# EasyEDA Pro project ProProject_AT32F403ACGT6_2024-07-07.epro

# Schematic Schematic1
Create Date: 2024-06-18; Page Name: P1; Project Name: AT32F403ACGT6; Schematic Name: Schematic1; Update Date: 2024-06-18; Company: 嘉立创EDA; Page Size: A4; Version: V1.0
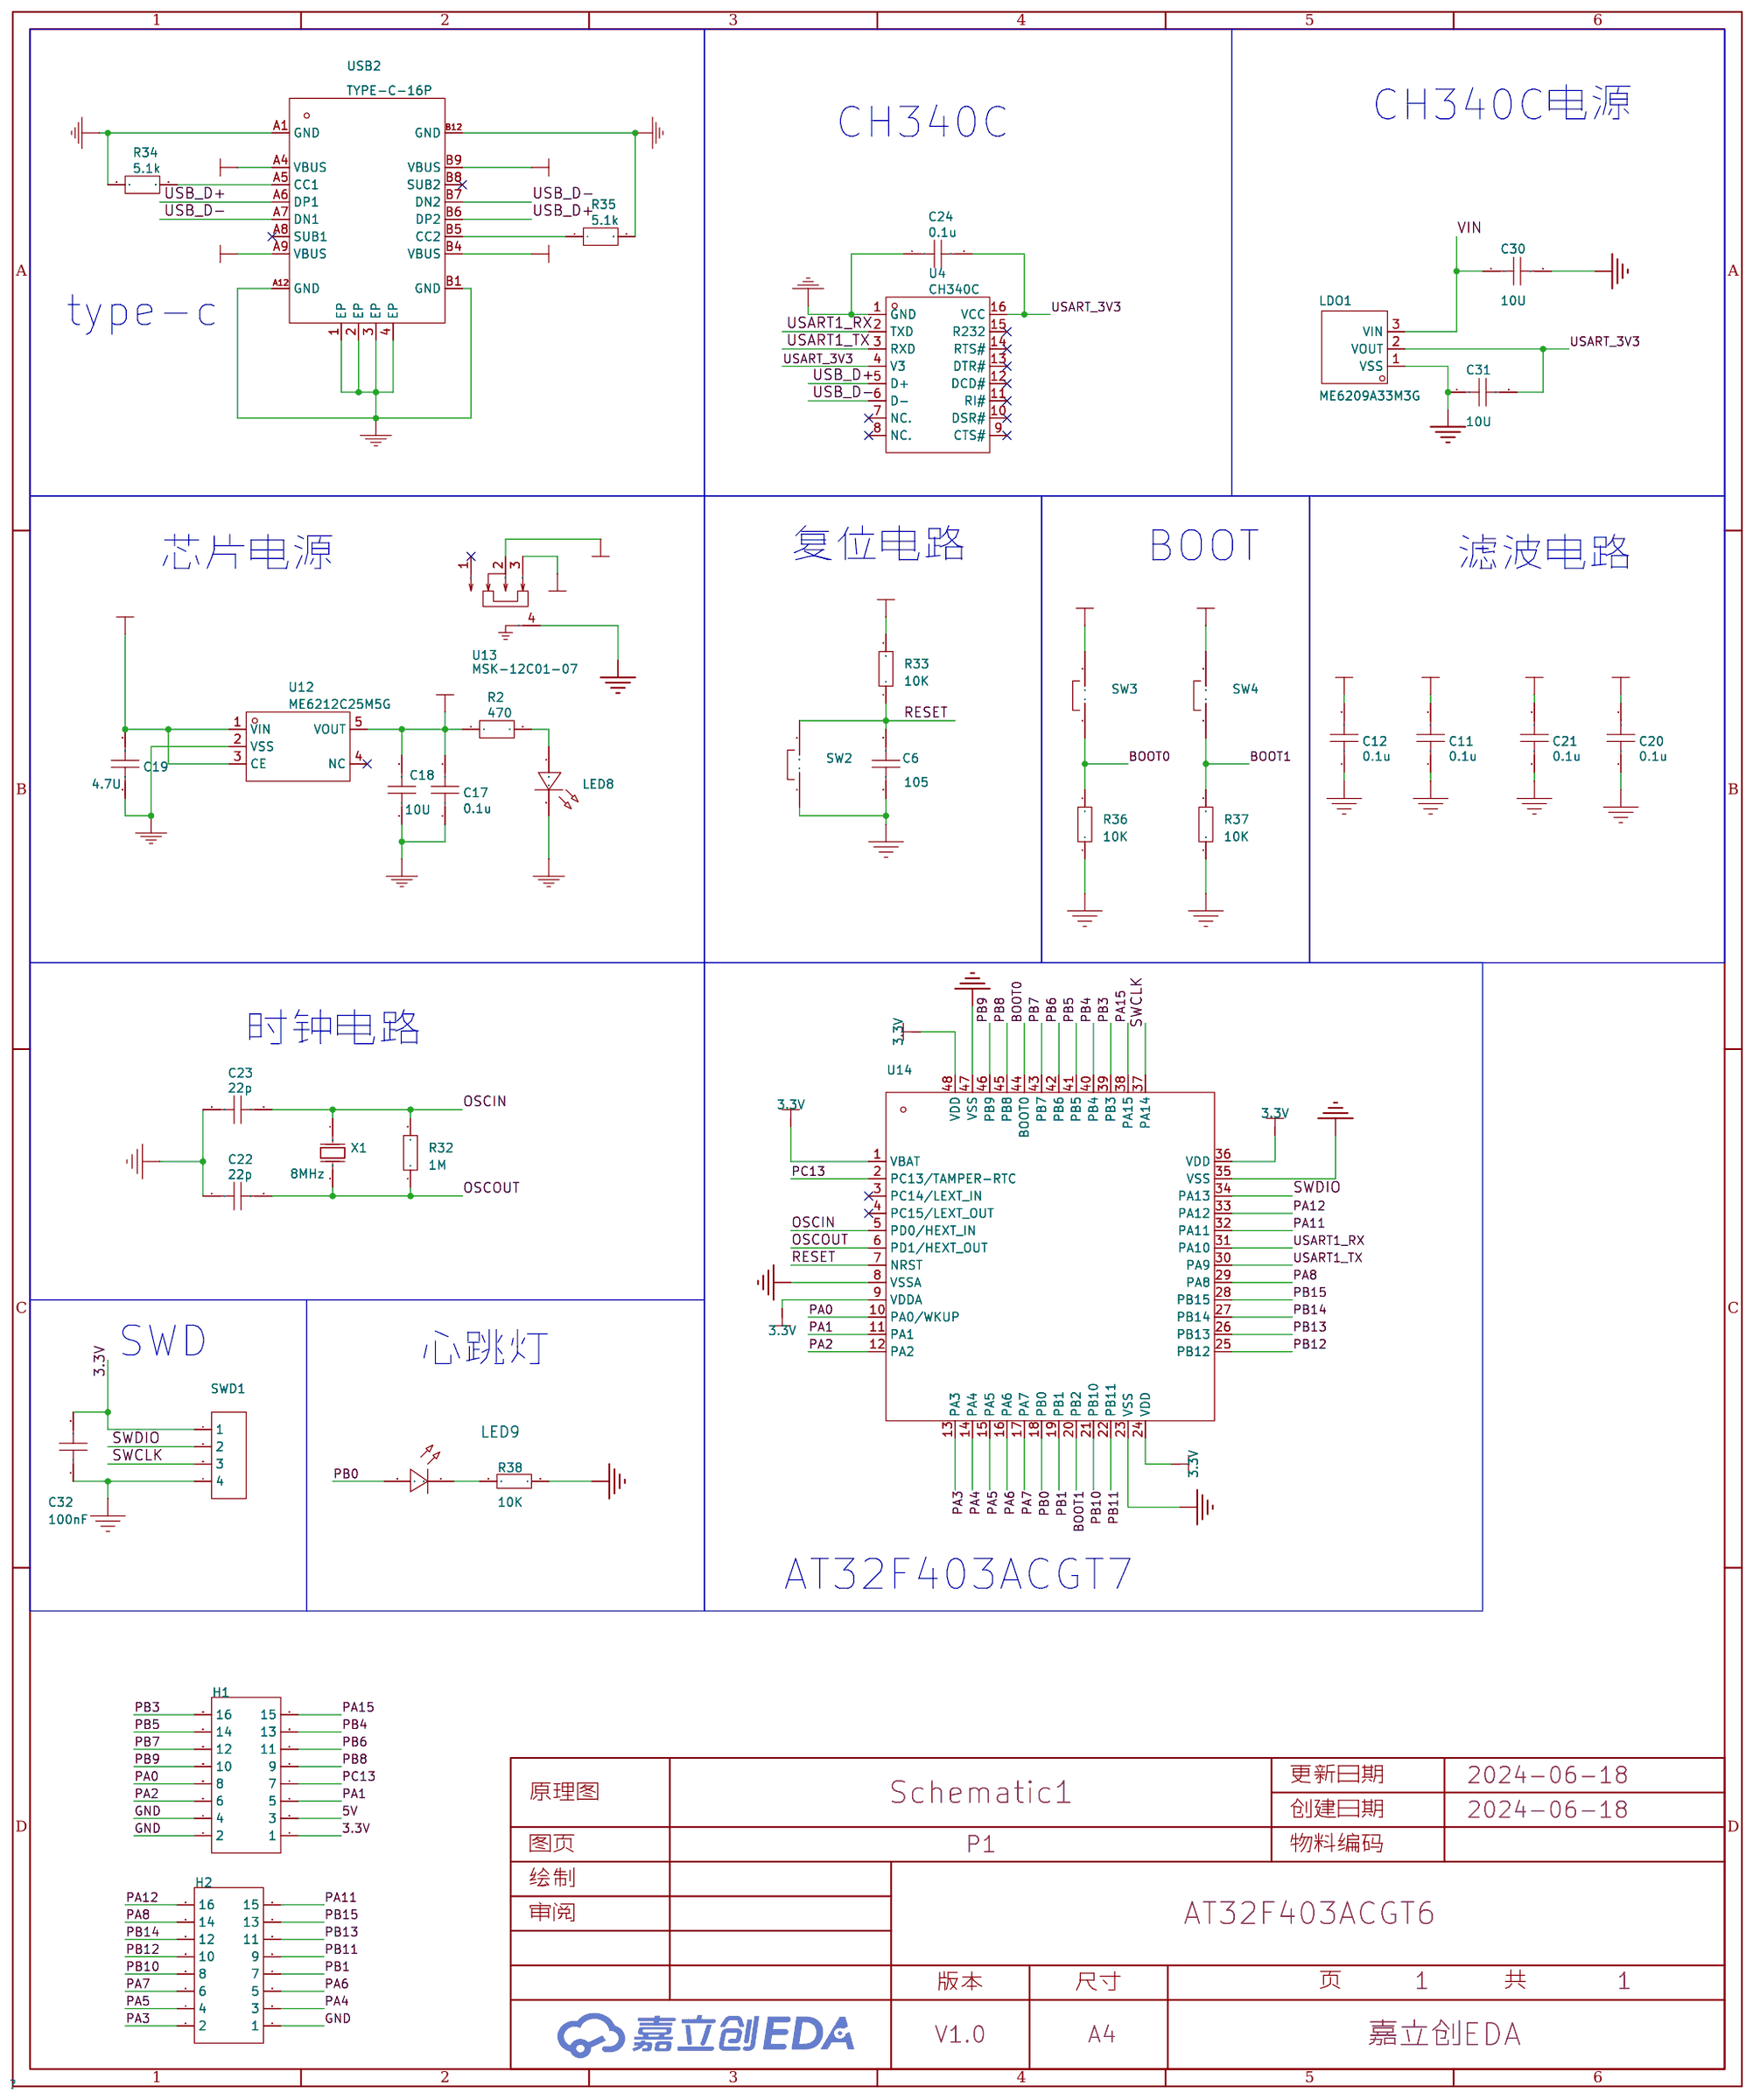
[diagram p0: schematic sheet]

## Parts
C6  105  [footprint_88df]
C11  0.1u  [footprint_88df]
C12  0.1u  [footprint_88df]
C17  0.1u  [footprint_d063]
C18  10U  [footprint_d063]
C19  4.7U  [footprint_d063]
C20  0.1u  [footprint_88df]
C21  0.1u  [footprint_88df]
C22  22p  [footprint_88df]
C23  22p  [footprint_88df]
C24  0.1u  [footprint_d063]
C30  10U  [C0603]
C31  10U  [C0603]
C32  100nF  [C0603]
H1  -  [HDR-TH_16P-P2.54-V-M-R2-C8-S2.54]
H2  -  [HDR-TH_16P-P2.54-V-M-R2-C8-S2.54]
LDO1  ME6209A33M3G  [SOT-23-3_L2.9-W1.6-P1.90-LS2.8-BR]
LED8  LED-0603_R  [footprint_1210]
LED9  -  [LED_0603]
R2  470  [footprint_1dde]
R32  1M  [R0603]
R33  10K  [R0603]
R34  5.1k  [footprint_1dde]
R35  5.1k  [footprint_1dde]
R36  10K  [R0603]
R37  10K  [R0603]
R38  10K  [R0603]
SW2  3*6*5贴片按键开关  [footprint_ea54]
SW3  3*6*5贴片按键开关  [footprint_ea54]
SW4  3*6*5贴片按键开关  [footprint_ea54]
SWD1  HDR-M-2.54_1x4  [footprint_c5e7]
U4  CH340C  [footprint_26da]
U12  ME6212C25M5G  [footprint_203e]
U13  MSK-12C01-07  [SW-SMD_MSK12CO2-BDM]
U14  -  [LQFP-48_L7.0-W7.0-P0.50-LS9.0-BL]
USB2  TYPE-C-16P  [footprint_feef]
X1  8MHz  [CRYSTAL-SMD_L11.5-W4.8-LS12.7]

## Library data of the parts
C6 = 105
C11 C12 C20 C21 = 1u
C17 C24 = 0.1u
C18 = 10U
C19 = 4.7U
C22 C23 = 22p
C30-C32 = CAP_0603: Supplier Footprint: 0603
H1 H2 = HDR-M_2.54_2x8: Supplier Part: C68234; Supplier Footprint: 插件,P=2.54mm
LDO1 = ME6209A33M3G: 输出类型:固定;最大输入电压:18V;输出电压:3.3V;最大输出电流:250mA;电源纹波抑制比(PSRR):-;输出极性:正极;; LCSC Part Name: 输入18V 输出3.3V 250mA; Supplier Part: C83508; Manufacturer: MICRONE(南京微盟); Supplier Footprint: SOT-23-3L; JLCPCB Part Class: 扩展库; Datasheet: https://atta.szlcsc.com/upload/public/pdf/source/20161212/1481539101152.pdf; Supplier: LCSC; Output Type: 固定; Maximum Input Voltage: 18V; Output Voltage: 3.3V; MAX Output Current: 250mA; Dropout Voltage: 80mV@(40mA); Output Polarity: 正极; Number of Outputs: 1
LED8 = LED-0603_R: Manufacturer: EVERLIGHT(台湾亿光); Manufacturer Part: 19-217/R6C-AL1M2VY/3T; Supplier Part: C72044; Supplier: LCSC
LED9 = LED_0603-R: Supplier Footprint: 0603
R2 = 470
R32 R33 R36-R38 = Res_0603: Supplier Footprint: 0603
R34 R35 = 5.1k
SW2-SW4 = 3*6*5贴片按键开关
SWD1 = HDR-M-2.54_1x4: Supplier Part: C124378; Supplier: LCSC
U4 = CH340C
U12 = ME6212C25M5G: Supplier: LCSC; Supplier Part: C2911282; Manufacturer: MICRONE(南京微盟); JLCPCB Part Class: Extended Part; link: https://so.szlcsc.com/global.html?k=C2911282&amp;ref=editor
U13 = MSK-12C01-07: Supplier: LCSC; Supplier Part: C9900005167; Manufacturer: null; JLCPCB Part Class: Extended Part
U14 = AT32F403ACxT7: 由官方提供; Manufacturer: Artery Technology
USB2 = TYPE-C-16P: Supplier: LCSC; Supplier Part: C709357; Manufacturer: Shenzhen Kinghelm Elec; Manufacturer Part: KH-TYPE-C-16P; JLCPCB Part Class: Extended Part
X1 = X49SM8MSD2SC: 晶振类型:贴片晶振;频率:8MHz;常温频差:±20ppm;外接负载电容:20pF;频率稳定度(全温):±30ppm;; LCSC Part Name: 8MHz ±20ppm 20pF; Supplier Part: C12674; Manufacturer: YXC(扬兴晶振); Supplier Footprint: HC-49S-SMD; JLCPCB Part Class: 基础库; Datasheet: https://atta.szlcsc.com/upload/public/pdf/source/20210329/C106809_0E91E60850A780B284B63D653DC40EA4.pdf; Supplier: LCSC; Crystal Type: 贴片晶振; Normal temperature Frequency Tolerance: ±20ppm; External load capacitor: 20pF; Frequency Stability(Full temperature range): ±30ppm; Operating Temperature: -20℃~+70℃

## Nets
3.3V: C11.2 C12.2 C17.2 C18.2 C20.2 C21.2 C32.2 H1.1 R2.1 R33.2 SW3.2 SW4.2 SWD1.1 U12.5(VOUT) U14.1(VBAT) U14.9(VDDA) U14.24(VDD) U14.36(VDD) U14.48(VDD)
5V: C19.2 H1.3 U12.1(VIN) U12.3(CE) U13.2
GND: C6.1 C11.1 C12.1 C17.1 C18.1 C19.1 C20.1 C21.1 C22.1 C23.1 C24.1 C30.2 C31.1 C32.1 H1.2 H1.4 H2.1 LDO1.1(VSS) LED8.2 R34.1 R35.2 R36.1 R37.1 R38.2 SW2.1 SWD1.4 U4.1(GND) U12.2(VSS) U13.4 U14.8(VSSA) U14.23(VSS) U14.35(VSS) U14.47(VSS) USB2.1(EP) USB2.2(EP) USB2.3(EP) USB2.4(EP) USB2.A1(GND) USB2.A12(GND) USB2.B1(GND) USB2.B12(GND)
VIN: C30.1 LDO1.3(VIN) U13.3 USB2.A4(VBUS) USB2.A9(VBUS) USB2.B4(VBUS) USB2.B9(VBUS)
BOOT0: R36.2 SW3.1 U14.44(BOOT0)
BOOT1: R37.2 SW4.1 U14.20(PB2)
OSCIN: C23.2 R32.2 U14.5(PD0/HEXT_IN) X1.1(OSC1)
OSCOUT: C22.2 R32.1 U14.6(PD1/HEXT_OUT) X1.2(OSC2)
PA0: H1.8 U14.10(PA0/WKUP)
PA1: H1.5 U14.11(PA1)
PA2: H1.6 U14.12(PA2)
PA3: H2.2 U14.13(PA3)
PA4: H2.3 U14.14(PA4)
PA5: H2.4 U14.15(PA5)
PA6: H2.5 U14.16(PA6)
PA7: H2.6 U14.17(PA7)
PA8: H2.14 U14.29(PA8)
PA11: H2.15 U14.32(PA11)
PA12: H2.16 U14.33(PA12)
PA15: H1.15 U14.38(PA15)
PB0: LED9.2(A) U14.18(PB0)
PB1: H2.7 U14.19(PB1)
PB3: H1.16 U14.39(PB3)
PB4: H1.13 U14.40(PB4)
PB5: H1.14 U14.41(PB5)
PB6: H1.11 U14.42(PB6)
PB7: H1.12 U14.43(PB7)
PB8: H1.9 U14.45(PB8)
PB9: H1.10 U14.46(PB9)
PB10: H2.8 U14.21(PB10)
PB11: H2.9 U14.22(PB11)
PB12: H2.10 U14.25(PB12)
PB13: H2.11 U14.26(PB13)
PB14: H2.12 U14.27(PB14)
PB15: H2.13 U14.28(PB15)
PC13: H1.7 U14.2(PC13/TAMPER-RTC)
RESET: C6.2 R33.1 SW2.2 U14.7(NRST)
SWCLK: SWD1.3 U14.37(PA14)
SWDIO: SWD1.2 U14.34(PA13)
USART1_RX: U4.2(TXD) U14.31(PA10)
USART1_TX: U4.3(RXD) U14.30(PA9)
USART_3V3: C24.2 C31.2 LDO1.2(VOUT) U4.4(V3) U4.16(VCC)
USB_D+: U4.5(D+) USB2.A6(DP1) USB2.B6(DP2)
USB_D-: U4.6(D-) USB2.A7(DN1) USB2.B7(DN2)
$1N602: R35.1 USB2.B5(CC2)
$1N604: R34.2 USB2.A5(CC1)
$1N1124: LED8.1 R2.2
$1N4539: LED9.1(C) R38.1

Not connected (* = marked no-connect by the designer): U4 7(NC.)* 8(NC.)* 9(CTS#)* 10(DSR#)* 11(RI#)* 12(DCD#)* 13(DTR#)* 14(RTS#)* 15(R232)*; U12 4(NC)*; U13 1*; U14 3(PC14/LEXT_IN)* 4(PC15/LEXT_OUT)*; USB2 A8(SUB1)* B8(SUB2)*

## Notes on the sheet
- CH340C
- CH340C电源
- type-c
- 复位电路
- BOOT
- 芯片电源
- 滤波电路
- 时钟电路
- SWD
- 心跳灯
- AT32F403ACGT7

# Board PCB1
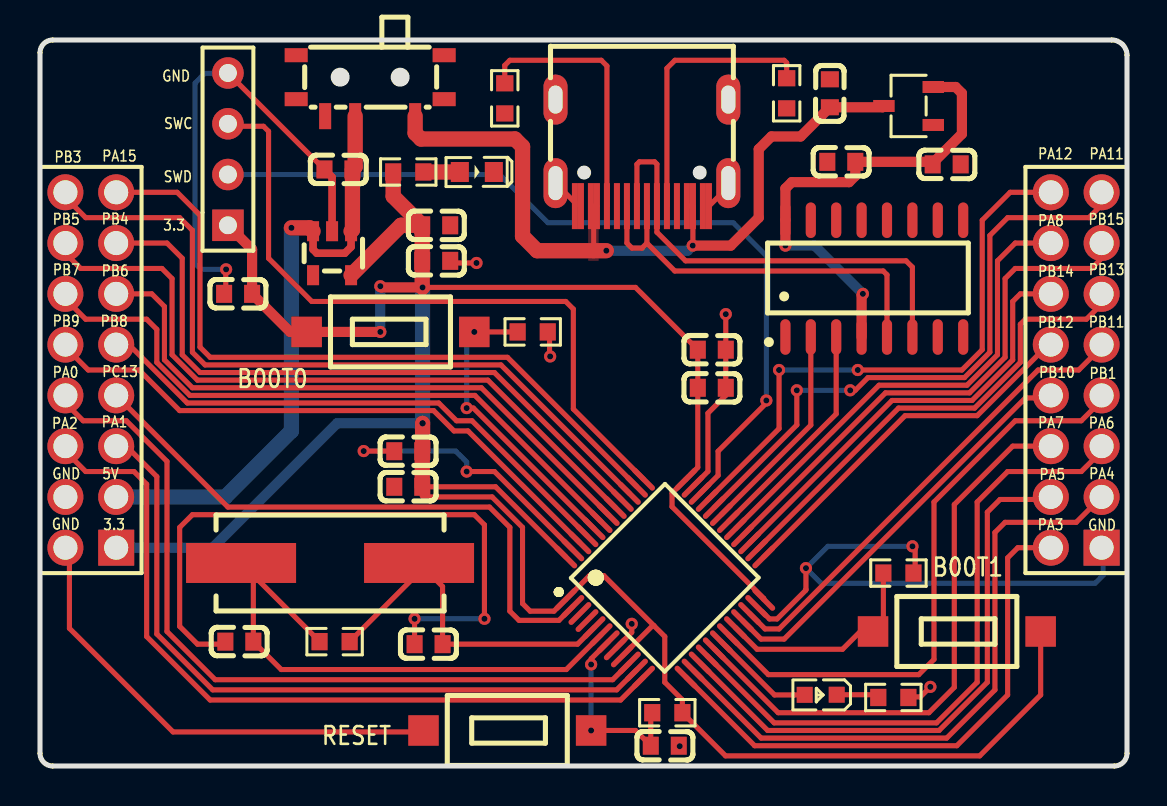
[diagram p1: board, top side]
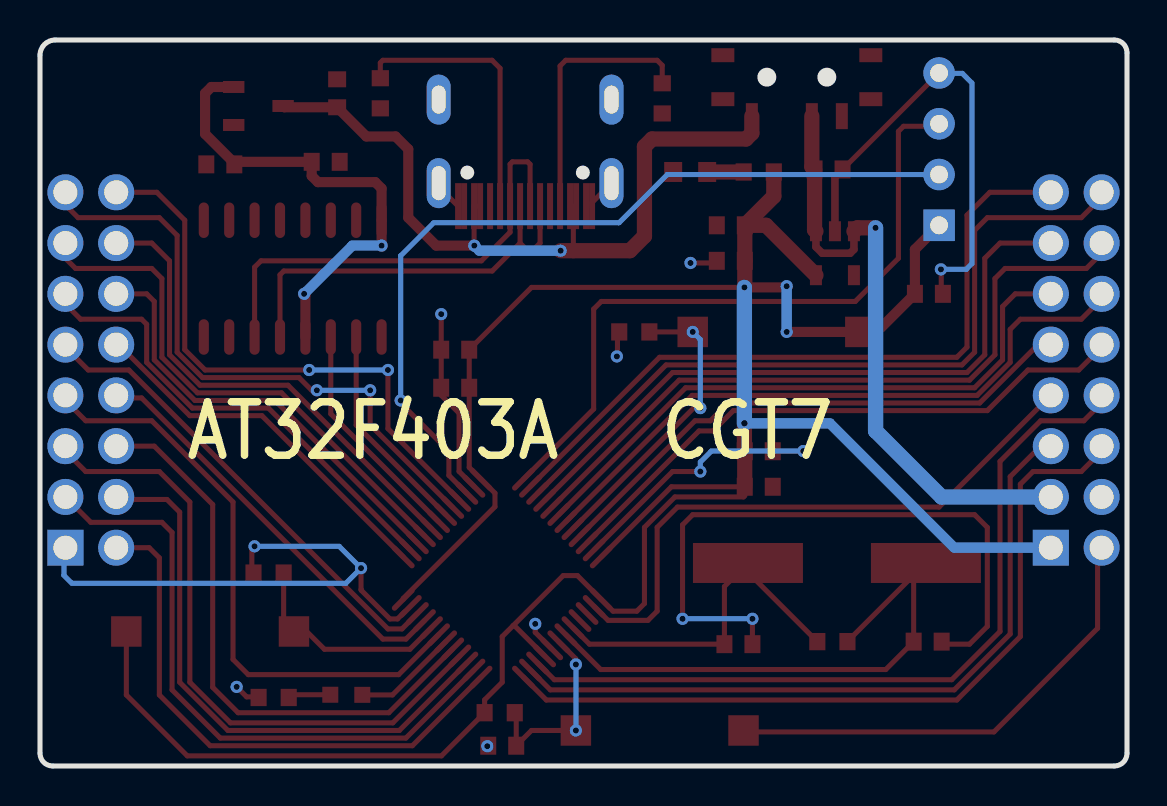
[diagram p2: board, bottom side, seen from below]

Outline 54.36 x 36.32 mm; copper layers: Top Layer, Bottom Layer. Coordinates in mm from the lower left corner of the outline.
Outline path: 0,35.69 arc(0.19,36.14) 0.63,36.32 53.59,36.32 arc(54.13,36.1) 54.36,35.56 54.36,0.63 arc(54.17,0.19) 53.72,0 0.63,0 arc(0.19,0.19) 0,0.63 0,35.69
Stack: Top Layer 0.035mm / Dielectric1 1.51mm FR4 er 4.5 / Bottom Layer 0.035mm

## Design rules (mm)
template: JLCPCB Capability(Two Layers Board)
spacing copperThickness1oz (default): track to track 0.102, other pairs 0.152 to 0.3
spacing copperThickness2oz: track to track 0.203, other pairs 0.152 to 0.3
track width copperThickness1oz (default): min 0.127, default 0.254, max 2.54
track width copperThickness2oz: min 0.203, default 0.254, max 2.54
differential pair differentialPair (default): width min 0.127, default 0.254, max 2.54; gap min 0.152, default 0.152
via viaSize (default): diameter min 0.5, default 0.61, max 10; hole min 0.3, default 0.305, max 6.3

## Placement (name value [footprint] x y rotation side)
C6  105  [footprint_88df]  31.24 1.02 180 top
C11  0.1u  [footprint_88df]  18.42 15.75 0 top
C12  0.1u  [footprint_88df]  33.59 20.83 180 top
C17  0.1u  [footprint_d063]  19.81 25.27 180 top
C18  10U  [footprint_d063]  19.81 27.05 180 top
C19  4.7U  [footprint_d063]  14.92 29.84 0 top
C20  0.1u  [footprint_88df]  33.59 18.92 180 top
C21  0.1u  [footprint_88df]  18.42 13.97 0 top
C22  22p  [footprint_88df]  9.97 6.22 0 top
C23  22p  [footprint_88df]  19.43 6.1 0 top
C24  0.1u  [footprint_d063]  45.34 30.1 180 top
C30  10U  [C0603]  39.5 33.66 90 top
C31  10U  [C0603]  40.07 30.23 0 top
C32  100nF  [C0603]  9.91 23.62 0 top
H1  -  [HDR-TH_16P-P2.54-V-M-R2-C8-S2.54]  2.54 19.81 90 top
H2  -  [HDR-TH_16P-P2.54-V-M-R2-C8-S2.54]  51.82 19.81 90 top
LDO1  ME6209A33M3G  [SOT-23-3_L2.9-W1.6-P1.90-LS2.8-BR]  43.43 33.02 0 top
LED8  LED-0603_R  [footprint_1210]  21.84 29.72 0 top
LED9  -  [LED_0603]  38.99 3.56 180 top
R2  470  [footprint_1dde]  18.42 29.72 0 top
R32  1M  [R0603]  14.73 6.22 0 top
R33  10K  [R0603]  31.37 2.67 0 top
R34  5.1k  [footprint_1dde]  37.34 33.66 90 top
R35  5.1k  [footprint_1dde]  23.24 33.4 270 top
R36  10K  [R0603]  24.64 21.72 180 top
R37  10K  [R0603]  42.93 9.65 180 top
R38  10K  [R0603]  42.67 3.43 0 top
SW2  3*6*5贴片按键开关  [footprint_ea54]  23.37 1.78 180 top
SW3  3*6*5贴片按键开关  [footprint_ea54]  17.53 21.72 0 top
SW4  3*6*5贴片按键开关  [footprint_ea54]  45.85 6.73 180 top
SWD1  HDR-M-2.54_1x4  [footprint_c5e7]  9.4 30.86 90 top
U4  CH340C  [footprint_26da]  41.27 24.38 0 top
U12  ME6212C25M5G  [footprint_203e]  14.61 25.65 180 top
U13  MSK-12C01-07  [SW-SMD_MSK12CO2-BDM]  16.51 34.04 180 top
U14  -  [LQFP-48_L7.0-W7.0-P0.50-LS9.0-BL]  31.24 9.4 315 top
USB2  TYPE-C-16P  [footprint_feef]  30.1 30.92 180 top
X1  8MHz  [CRYSTAL-SMD_L11.5-W4.8-LS12.7]  14.5 10.16 180 top

## Footprints (pads in the part's own frame, mm; a bottom-side part is the same pattern mirrored in y, then rotated)
C0603
  rect 0.8x0.9 smd: 1(-0.7,0) 2(0.7,0)
CRYSTAL-SMD_L11.5-W4.8-LS12.7
  rect 5.5x2 smd: 1(-4.45,0) 2(4.45,0)
footprint_1dde
  rect 0.806x0.864 smd: 1(-0.753,0) 2(0.753,0)
footprint_26da
  oval 0.508x1.778 smd: 1(-4,-2.921) 2(-2.731,-2.921) 3(-1.46,-2.921) 4(-0.191,-2.921) 5(1.079,-2.921) 6(2.349,-2.921) 7(3.619,-2.921) 8(4.889,-2.921) 9(4.889,2.921) 10(3.619,2.921) 11(2.349,2.921) 12(1.079,2.921) 13(-0.191,2.921) 14(-1.46,2.921) 15(-2.731,2.921) 16(-4,2.921)
footprint_88df
  rect 0.8x0.9 smd: 1(-0.7,0) 2(0.7,0)
footprint_203e
  rect 0.6x1 smd: 1(-0.95,-1.1) 2(0,-1.1) 3(0.95,-1.1) 4(0.95,1.1) 5(-0.95,1.1)
footprint_1210
  rect 0.9x1 smd: 1(-0.85,0) 2(0.85,0)
footprint_c5e7
  rect 1.575x1.575 hole 0.889: 1(-3.81,0)
  round 1.575 hole 0.889: 2(-1.27,0) 3(1.27,0) 4(3.81,0)
footprint_d063
  rect 0.8x0.9 smd: 1(-0.7,0) 2(0.7,0)
footprint_ea54
  rect 1.524x1.524 smd: 1(4.191,0) 2(-4.191,0)
footprint_feef
  oval 1.2x2.5 hole 0.7x1.7: 1(-4.32,1.765) 2(4.32,1.765)
  oval 1.2x2.5 hole 0.7x1.4: 3(-4.32,-2.415) 4(4.32,-2.415)
  rect 0.3x2.3 smd: A1(-3.35,2.915) A4(-2.55,2.915) A5(-1.25,2.915) A6(-0.25,2.915) A7(0.25,2.915) A8(1.25,2.915) A9(2.55,2.915) A12(3.35,2.915) B1(3.05,2.915) B4(2.25,2.915) B5(1.75,2.915) B6(0.75,2.915) B7(-0.75,2.915) B8(-1.75,2.915) B9(-2.25,2.915) B12(-3.05,2.915)
HDR-TH_16P-P2.54-V-M-R2-C8-S2.54
  rect 1.8x1.8 hole 1.2: 1(-8.89,-1.27)
  round 1.8 hole 1.2: 2(-8.89,1.27) 3(-6.35,-1.27) 4(-6.35,1.27) 5(-3.81,-1.27) 6(-3.81,1.27) 7(-1.27,-1.27) 8(-1.27,1.27) 9(1.27,-1.27) 10(1.27,1.27) 11(3.81,-1.27) 12(3.81,1.27) 13(6.35,-1.27) 14(6.35,1.27) 15(8.89,-1.27) 16(8.89,1.27)
LED_0603
  rect 0.8x0.8 smd: 1(-0.851,-0.01) 2(0.75,-0.005)
LQFP-48_L7.0-W7.0-P0.50-LS9.0-BL
  oval 0.27x1.5 smd: 1(-2.75,-4.25) 2(-2.25,-4.25) 3(-1.75,-4.25) 4(-1.25,-4.25) 5(-0.75,-4.25) 6(-0.25,-4.25) 7(0.25,-4.25) 8(0.75,-4.25) 9(1.25,-4.25) 10(1.75,-4.25) 11(2.25,-4.25) 12(2.75,-4.25) 25(2.75,4.25) 26(2.25,4.25) 27(1.75,4.25) 28(1.25,4.25) 29(0.75,4.25) 30(0.25,4.25) 31(-0.25,4.25) 32(-0.75,4.25) 33(-1.25,4.25) 34(-1.75,4.25) 35(-2.25,4.25) 36(-2.75,4.25)
  oval 1.5x0.27 smd: 13(4.25,-2.75) 14(4.25,-2.25) 15(4.25,-1.75) 16(4.25,-1.25) 17(4.25,-0.75) 18(4.25,-0.25) 19(4.25,0.25) 20(4.25,0.75) 21(4.25,1.25) 22(4.25,1.75) 23(4.25,2.25) 24(4.25,2.75) 37(-4.25,2.75) 38(-4.25,2.25) 39(-4.25,1.75) 40(-4.25,1.25) 41(-4.25,0.75) 42(-4.25,0.25) 43(-4.25,-0.25) 44(-4.25,-0.75) 45(-4.25,-1.25) 46(-4.25,-1.75) 47(-4.25,-2.25) 48(-4.25,-2.75)
R0603
  rect 0.806x0.864 smd: 1(-0.753,0) 2(0.753,0)
SOT-23-3_L2.9-W1.6-P1.90-LS2.8-BR
  rect 1.07x0.6 smd: 1(1.235,-0.95) 2(1.235,0.95) 3(-1.235,0)
SW-SMD_MSK12CO2-BDM
  rect 0.6x1.3 smd: 1(2.25,1.525) 2(0.75,1.525) 3(-2.25,1.525)
  rect 1.15x0.7 smd: 4(-3.7,0.675) 4(-3.7,-1.525) 4(3.7,0.675) 4(3.7,-1.525)

## Nets
As in the schematic.

Pads without a net: U4 7 8 9 10 11 12 13 14 15; U12 4; U13 1; U14 3 4; USB2 A8 B8

## Via types
v1: diameter 0.61, hole 0.305, Top Layer to Bottom Layer, 32 vias

## Routing (per net, layer and track width the routed paths; a pad name or vN(x,y) marks a point on that pad's centre or on a via; arc(x,y) is an arc through that point)
3.3V: length 141.8
  Top Layer w0.254: 30.7,7.02 28.19,9.52 27.48,9.52 U14.1 25.7,7.75 24.51,7.75 24.13,8.13 24.13,11.94 22.61,13.46 19.18,13.46 19.11,13.52 C21.2 22.78,13.97 U14.48 ; 30.7,7.02 31.24,6.48 31.24,4.19 32.12,3.31 R33.2 34.28,0.51 46.99,0.51 50.04,3.56 SW4.2 ; 30.7,7.02 30.63,7.02 U14.9 ; U14.24 36.19,8.39 31.61,12.97 31.61,13.65 U14.36 32.89,14.94 C20.2 C12.2 29.78,23.94 v1(19.13,23.94)
  Top Layer w0.508: SWD1.1 10.61,25.84 C32.2 12.51,21.72 SW3.2 v1(17.02,21.72) ; v1(19.13,23.94) 17.08,23.94 v1(17.02,24)
  Top Layer w0.762: C18.2 17.66,28.5 R2.1 ; C18.2 18.05,27.05 U12.5 ; C18.2 C17.2 19.11,23.96 v1(19.13,23.94) ; C21.2 C11.2 19.13,15.76 v1(19.13,17.14)
  Bottom Layer w0.508: H1.1 8.64,10.92 14.86,17.14 v1(19.13,17.14) ; v1(17.02,21.72) v1(17.02,24)
  Bottom Layer w0.762: v1(19.13,23.94) v1(19.13,17.14)
5V: length 31.1
  Top Layer w0.381: U12.3 13.65,25.84 13.84,25.65 15.24,25.65 15.55,25.97 U12.1
  Top Layer w0.762: v1(12.57,26.92) 13.48,26.92 U12.3 ; U12.1 15.62,26.82 C19.2 15.76,29.98 U13.2
  Bottom Layer w0.762: v1(12.57,26.92) 12.57,16.76 9.27,13.46 H1.3
GND: length 139.7
  Top Layer w0.254: U14.8 29.59,6.69 v1(29.59,7.11) ; v1(34.29,22.61) C12.1 C20.1 34.29,18.55 33.4,17.65 33.4,14.74 32.66,13.99 ; v1(38.3,9.9) 38.3,8.84 38.29,8.83 38.29,8.79 36.86,7.36 36.48,7.36 36.12,7.72 ; 19.15,1.71 6.65,1.71 1.47,6.89 1.47,10.48 ; C23.1 v1(18.73,7.37) ; USB2.1 34.42,28.98 USB2.A1 ; v1(44.52,3.96) 44.02,3.46 43.68,3.46 ; 9.27,6.22 9.14,6.1 7.87,6.1 6.98,6.98 6.98,11.94 7.62,12.57 21.72,12.57 22.23,12.06 v1(22.23,7.37) ; v1(21.34,14.73) 22.73,14.73 26.65,10.81 ; 9.29,23.55 9.29,24.83 v1(9.31,24.85) ; USB2.A12 26.75,28.19 USB2.2 ; v1(43.63,10.99) 43.76,10.86 43.76,9.66 ; v1(25.51,20.49) 25.48,20.52 25.48,21.66 ; 17.63,15.76 v1(16.19,15.76) ; 20.67,25.17 v1(21.83,25.17) ; SWD1.4 C19.1
  Top Layer w0.381: U12.2 14.61,29.46 C19.1
  Bottom Layer w0.254: v1(9.31,24.85) 8.04,24.85 7.76,25.13 7.76,34.17 8.23,34.65 9.43,34.65 ; v1(18.73,7.37) v1(22.23,7.37) ; v1(21.34,14.73) 21.34,15.21 20.79,15.76 v1(16.19,15.76) ; v1(43.63,10.99) 39.39,10.99 v1(38.3,9.9) 39.06,9.14 52.76,9.14 53.16,9.55 53.16,10.88
  vias: v1(31.99,0.99)
VIN: length 39.2
  Top Layer w0.254: 32.65,26.03 USB2.A4 USB2.B9 ; USB2.B4 USB2.A9 arc(27.65,27.97) 27.69,27.87 27.69,25.78
  Top Layer w0.508: 32.65,26.03 34.54,26.03 35.94,27.43 35.94,30.86 36.58,31.5 38.04,31.5 C30.1 42.13,32.95 LDO1.3
  Top Layer w0.762: U13.3 18.76,31.66 19.05,31.37 23.75,31.37 24.13,30.99 24.13,26.51 24.86,25.78 v1(28.32,25.78)
  Bottom Layer w0.508: v1(32.64,26.03) 32.39,25.78 v1(28.32,25.78)
BOOT0: length 15
  Top Layer w0.254: U14.44 21.67,17.91 v1(21.34,17.91) ; v1(21.72,21.72) R36.2
  Bottom Layer w0.254: v1(21.34,17.91) 21.34,21.34 v1(21.72,21.72)
BOOT1: length 10.8
  Top Layer w0.254: R37.2 42.17,7.25 SW4.1 41.02,6.73 40.13,5.84 35.86,5.84 U14.20
OSCIN: length 17.8
  Top Layer w0.254: R32.2 18.95,9.69 X1.1 20.13,8.98 C23.2 26.88,6.1 U14.5
OSCOUT: length 27.6
  Top Layer w0.254: 10.67,9.54 13.98,6.23 R32.1 ; 10.67,9.54 C22.2 12.06,4.83 26.32,4.83 28.06,6.57 ; 10.67,9.54 X1.2
PA0: length 39.7
  Top Layer w0.254: U14.10 28.64,4.32 8.76,4.32 6.35,6.73 6.35,15.24 4.32,17.27 2.16,17.27 1.27,18.16 H1.8
PA1: length 36.1
  Top Layer w0.254: H1.5 4.32,16 5.84,14.48 5.84,6.6 8.64,3.81 28.84,3.81 29.83,4.8
PA2: length 39.3
  Top Layer w0.254: H1.6 1.27,15.75 2.29,14.73 4.7,14.73 5.33,14.1 5.33,6.48 8.51,3.3 29.03,3.3 U14.12
PA3: length 27.8
  Top Layer w0.254: U14.13 35.73,1.02 45.85,1.02 48.39,3.56 48.39,10.41 48.89,10.92 50.55,10.92
PA4: length 31.5
  Top Layer w0.254: 32.66,4.8 36.06,1.4 45.34,1.4 47.75,3.81 47.75,11.68 48.26,12.19 51.82,12.19 H2.3
PA5: length 28.8
  Top Layer w0.254: 50.55,13.46 50.42,13.33 48.01,13.33 47.37,12.7 47.37,4.19 44.96,1.78 36.39,1.78 U14.15
PA6: length 32.3
  Top Layer w0.254: U14.16 36.71,2.16 44.83,2.16 46.86,4.19 46.86,13.21 48.39,14.73 52.07,14.73 53.09,15.75 H2.5
PA7: length 29
  Top Layer w0.254: U14.17 36.91,2.67 44.45,2.67 45.72,3.94 45.72,13.08 48.64,16 50.55,16
PA8: length 24.4
  Top Layer w0.254: 50.55,26.16 48.77,26.16 47.88,25.27 47.88,20.57 46.36,19.05 41.95,19.05 U14.29
PA11: length 30.7
  Top Layer w0.254: H2.15 53.09,28.07 52.45,27.43 48.39,27.43 47.5,26.54 47.5,20.7 46.23,19.43 41.4,19.43 40.77,18.8 v1(40.51,18.8) ; v1(37.85,18.8) 37.85,17.06 U14.32
  Bottom Layer w0.254: v1(37.85,18.8) v1(40.51,18.8)
PA12: length 29.1
  Top Layer w0.254: v1(36.96,19.81) 36.96,16.88 U14.33 ; v1(40.89,19.81) 46.1,19.81 47.12,20.83 47.12,27.3 48.51,28.7 50.55,28.7
  Bottom Layer w0.254: v1(40.89,19.81) v1(36.96,19.81)
PA15: length 36
  Top Layer w0.254: U14.38 23.37,20.45 8.51,20.45 8,20.95 8,27.56 6.86,28.7 H1.15
PB0: length 5.1
  Top Layer w0.254: 38.11,3.54 38.09,3.56 36.73,3.56 34.07,6.22
PB1: length 30
  Top Layer w0.254: U14.19 36.42,4.57 43.94,4.57 44.7,5.33 44.7,13.21 48.77,17.27 52.07,17.27 53.09,18.29 H2.7
PB3: length 38.2
  Top Layer w0.254: H1.16 1.27,28.45 2.29,27.43 6.98,27.43 7.62,26.8 7.62,20.7 8.25,20.07 23.05,20.07 U14.39
PB4: length 33.5
  Top Layer w0.254: U14.40 22.72,19.69 8,19.69 7.11,20.57 7.11,25.4 6.35,26.16 H1.13
PB5: length 35.5
  Top Layer w0.254: U14.41 22.4,19.3 7.87,19.3 6.6,20.57 6.6,24.38 6.1,24.89 2.03,24.89 1.27,25.65 H1.14
PB6: length 30.7
  Top Layer w0.254: H1.11 5.59,23.62 6.22,22.99 6.22,20.32 7.62,18.92 22.07,18.92 U14.42
PB7: length 32.6
  Top Layer w0.254: 28.06,12.23 21.74,18.54 7.49,18.54 5.84,20.19 5.84,21.84 5.33,22.35 2.29,22.35 1.27,23.37 H1.12
PB8: length 27.5
  Top Layer w0.254: U14.45 21.6,17.27 20.83,17.27 19.94,18.16 7.37,18.16 4.44,21.08 H1.9
PB9: length 29.9
  Top Layer w0.254: U14.46 21.4,16.76 20.7,16.76 19.68,17.78 6.98,17.78 4.95,19.81 2.41,19.81 1.27,20.95 H1.10
PB10: length 20.8
  Top Layer w0.254: U14.21 36.06,6.35 37.21,6.35 49.28,18.41 50.42,18.41 50.55,18.54
PB11: length 23.9
  Top Layer w0.254: U14.22 36.26,6.86 36.96,6.86 49.91,19.81 51.94,19.81 53.09,20.95 H2.9
PB12: length 18.8
  Top Layer w0.254: 50.55,21.08 50.42,21.08 46.86,17.53 43.26,17.53 U14.25
PB13: length 24
  Top Layer w0.254: 35.84,10.81 42.93,17.91 46.74,17.91 49.02,20.19 49.02,22.1 49.28,22.35 52.32,22.35 53.09,23.11 H2.11
PB14: length 21.9
  Top Layer w0.254: 50.55,23.62 49.02,23.62 48.64,23.24 48.64,20.32 46.61,18.29 42.61,18.29 U14.27
PB15: length 26.8
  Top Layer w0.254: H2.13 53.09,25.4 52.58,24.89 48.77,24.89 48.26,24.38 48.26,20.45 46.48,18.67 42.28,18.67 U14.28
PC13: length 30.2
  Top Layer w0.254: H1.7 9.4,12.95 22.48,12.95 23.49,11.94 23.49,7.75 23.95,7.29 25.95,7.29 26.65,7.98
RESET: length 9.8
  Top Layer w0.254: v1(27.56,1.78) 29.78,1.78 C6.2 30.54,2.59 R33.1 ; v1(27.56,5.08) 27.56,5.36 28.41,6.22
  Bottom Layer w0.254: v1(27.56,1.78) v1(27.56,5.08)
SWCLK: length 34.8
  Top Layer w0.254: U14.37 26.67,17.86 26.67,22.86 26.29,23.24 13.59,23.24 11.43,25.4 11.43,31.75 11.18,32 9.52,32 SWD1.3
SWDIO: length 41.9
  Top Layer w0.254: v1(36.32,18.29) 36.32,18.16 33.91,15.75 33.91,14.54 U14.34
  Bottom Layer w0.254: v1(36.32,18.29) 36.32,25.53 34.67,27.18 25.4,27.18 22.99,29.59 SWD1.2
USART1_RX: length 10.7
  Top Layer w0.254: U14.31 38.54,17.05 U4.2
USART1_TX: length 11.5
  Top Layer w0.254: U14.30 39.81,17.62 U4.3
USART_3V3: length 24
  Top Layer w0.508: 44.58,30.1 46.1,31.62 46.1,33.66 45.79,33.97 LDO1.2 ; 44.58,30.1 44.45,30.23 C31.2 40.77,29.52 40.46,29.21 37.59,29.21 37.27,28.89 U4.16 v1(37.27,26.03) ; 44.58,30.1 C24.2 ; v1(41.15,23.62) 41.08,23.56 U4.4
  Bottom Layer w0.508: v1(37.27,26.03) 38.73,26.03 v1(41.15,23.62)
USB_D+: length 20.7
  Top Layer w0.254: 30.35,26.16 31.74,24.77 42.16,24.77 42.35,24.57 U4.5 ; 30.35,26.16 USB2.A6 ; 30.35,26.16 30.1,25.91 29.6,25.91 29.35,26.16 USB2.B6
USB_D-: length 23.6
  Top Layer w0.254: USB2.A7 29.85,30.1 29.97,30.23 30.73,30.23 30.85,30.11 USB2.B7 30.85,26.71 32.28,25.27 43.31,25.27 43.62,24.96 U4.6
$1N602: length 13.2
  Top Layer w0.254: USB2.B5 28.35,35.02 28.07,35.31 23.49,35.31 23.24,35.05 R35.1
$1N604: length 13.9
  Top Layer w0.254: R34.2 37.34,35.18 37.21,35.31 31.75,35.31 31.35,34.91 USB2.A5
$1N1124: length 1.8
  Top Layer w0.762: LED8.1 R2.2
$1N4539: length 2.1
  Top Layer w0.254: R38.1 41.78,3.57 LED9.1

## Copper pours and planes (outline as drawn; the poured copper is in the pictures)
GND on Top Layer: -1.37,37.52 55.5,37.52 55.5,-1.88 -1.37,-1.88
GND on Bottom Layer: -1.76,37.65 56.52,37.65 56.52,-2.26 -1.76,-2.26
VIN on Top Layer: 27.41,29.16 27.94,29.16 27.94,25.27 27.41,25.27
VIN on Top Layer: 32.13,29.21 32.89,29.21 32.89,26.8 32.13,26.8

Small or netless copper shapes (teardrops, artwork), in the pictures only: 1 on Top Layer

## Text on the board
Bottom Silkscreen Layer: AT32F403A   CGT7
Top Silkscreen Layer: GND | PA2 | PB5 | PB9 | PA0 | PB7 | PB3 | PB8 | PB4 | PB6 | PA1 | PA15 | PC13 | 5V | 3.3 | SWD | SWC | PA3 | PA12 | PA8 | PB14 | PB12 | PA7 | PB10 | PA5 | PB15 | PB13 | PB11 | PA6 | PA4 | PA11 | PB1 | B00T0 | RESET | B00T1
